# EAGLE design ApHSC (EAGLE 7.2.0)
ApHSC <https://goo.gl/t2CsID> Arduino powered Heated Seats Controller Software <https://github.com/avluis/ApHSC> | Hardware <https://github.com/avluis/ApHSC-Hardware>
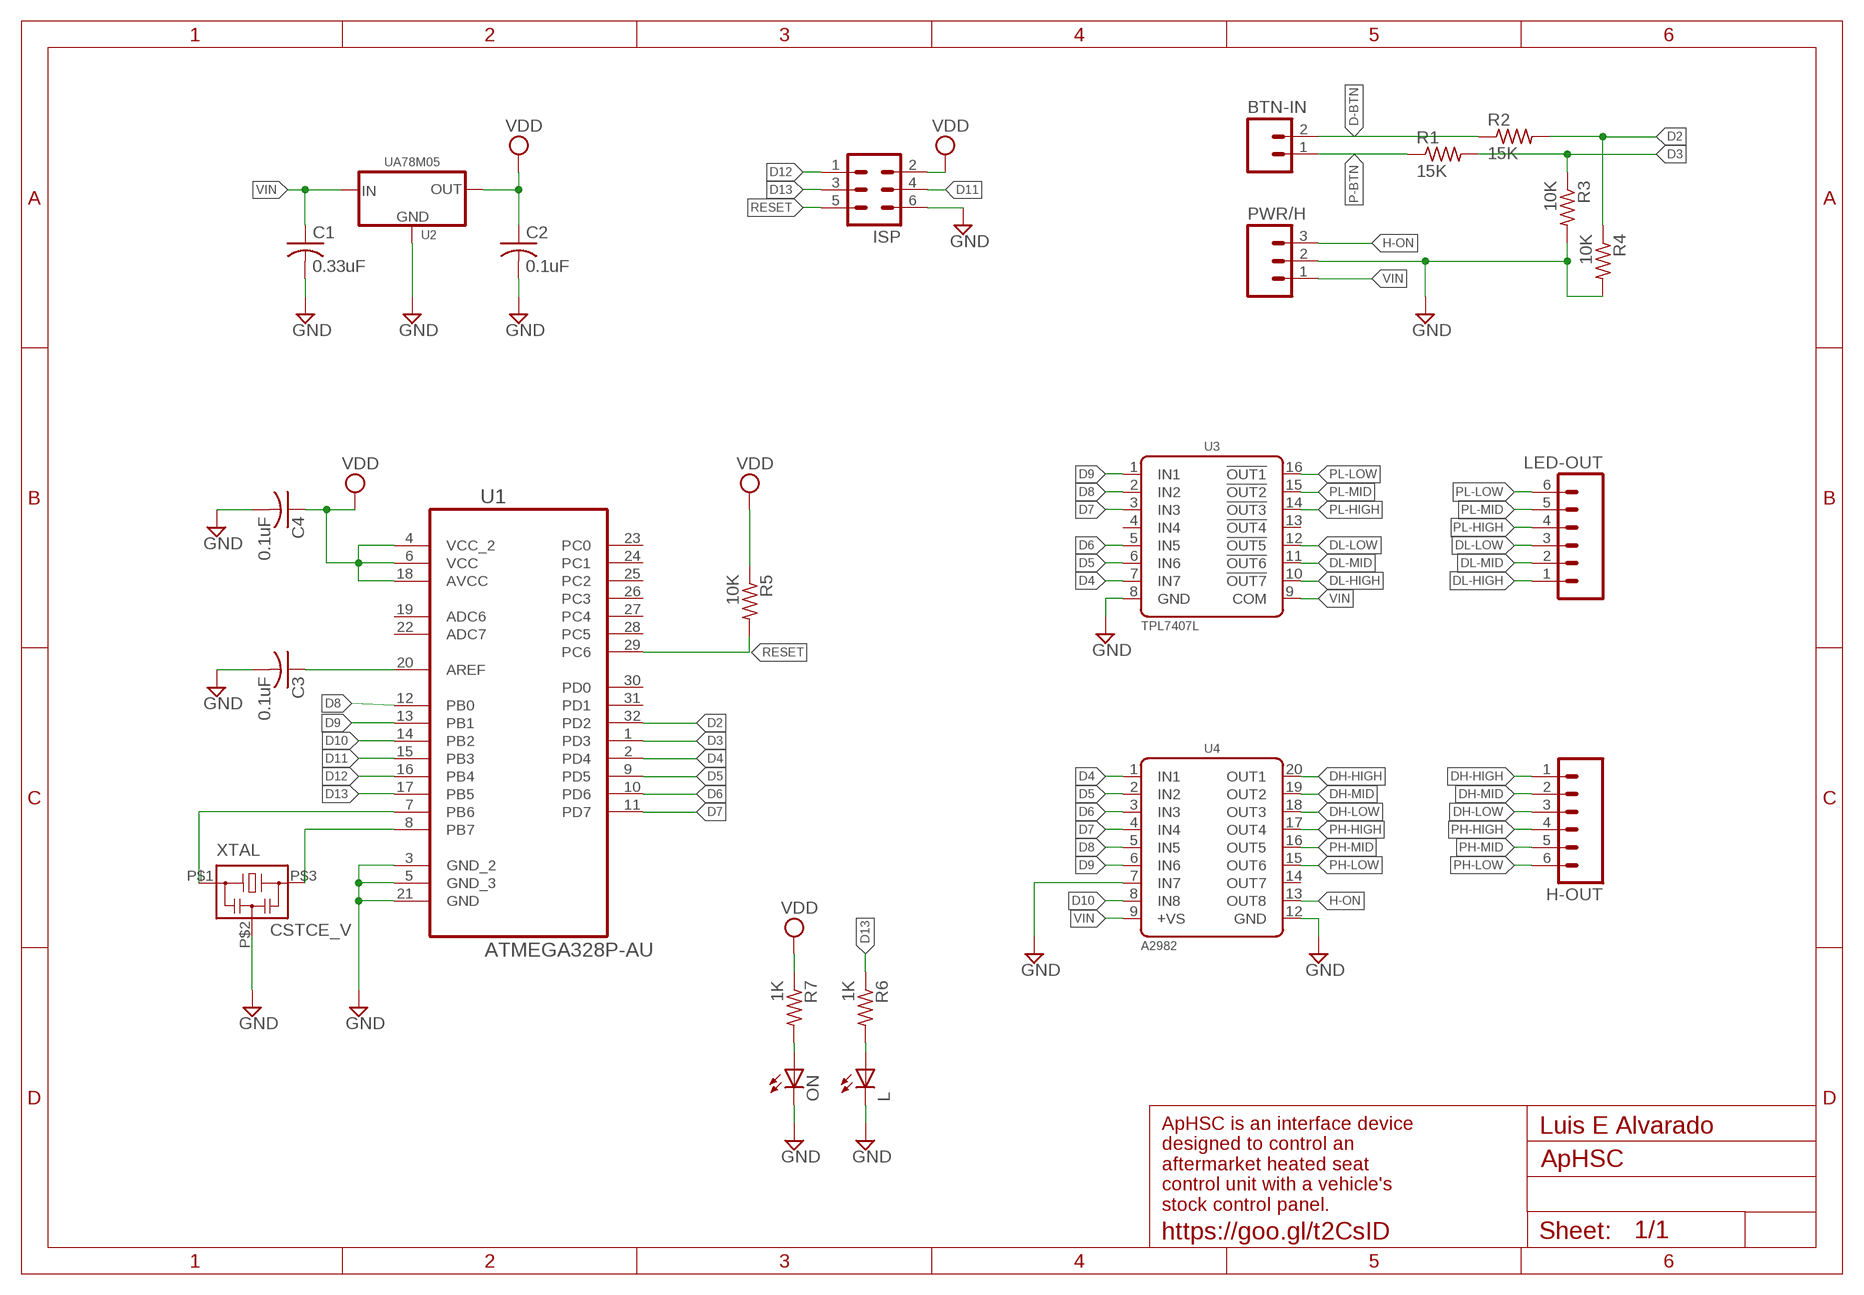
[diagram p0: schematic, sheet 1]

## Parts
BTN-IN  M02PTH  [1X02]
C1  0.33uF  C-USC0603  [C0603]
C2  0.1uF  C-USC0603  [C0603]
C3  0.1uF  C-USC0603  [C0603]
C4  0.1uF  C-USC0603  [C0603]
H-OUT  M06SIP  [1X06]
ISP  MA03-2  [MA03-2]
L  LEDCHIP-LED0603  [CHIP-LED0603]
LED-OUT  M06SIP  [1X06]
ON  LEDCHIP-LED0603  [CHIP-LED0603]
PWR/H  M03PTH  [1X03]
R1  15K  R-US_R0603  [R0603]
R2  15K  R-US_R0603  [R0603]
R3  10K  R-US_R0603  [R0603]
R4  10K  R-US_R0603  [R0603]
R5  10K  R-US_R0603  [R0603]
R6  1K  R-US_R0603  [R0603]
R7  1K  R-US_R0603  [R0603]
U1  ATMEGA328P-AU  [QFP80P900X900X120-32N]
U2  UA78M05  [SOT223]
U3  TPL7407L  [SOIC16N]
U4  A2982  [SOIC20W]
XTAL  CSTCE_V  [CSTCE_V]

## Nets
AREF: C3.1 U1.20(AREF)
D2: R2.2 R4.1 U1.32(PD2)
D3: R1.2 R3.1 U1.1(PD3)
D4: U1.2(PD4) U3.7(IN7) U4.1(IN1)
D5: U1.9(PD5) U3.6(IN6) U4.2(IN2)
D6: U1.10(PD6) U3.5(IN5) U4.3(IN3)
D7: U1.11(PD7) U3.3(IN3) U4.4(IN4)
D8: U1.12(PB0) U3.2(IN2) U4.5(IN5)
D9: U1.13(PB1) U3.1(IN1) U4.6(IN6)
D10: U1.14(PB2) U4.8(IN8)
D11: ISP.4 U1.15(PB3)
D12: ISP.1 U1.16(PB4)
D13: ISP.3 R6.1 U1.17(PB5)
D-BTN: BTN-IN.2 R2.1
DH-HIGH: H-OUT.1 U4.20(OUT1)
DH-LOW: H-OUT.3 U4.18(OUT3)
DH-MID: H-OUT.2 U4.19(OUT2)
DL-HIGH: LED-OUT.1 U3.10(!OUT7)
DL-LOW: LED-OUT.3 U3.12(!OUT5)
DL-MID: LED-OUT.2 U3.11(!OUT6)
GND: C1.2 C2.2 C3.2 C4.2 ISP.6 L.C ON.C PWR/H.2 R3.2 R4.2 U1.3(GND_2) U1.5(GND_3) U1.21(GND) U2.2(GND) U3.8(GND) U4.7(IN7) U4.12(GND) XTAL.P$2
H-ON: PWR/H.3 U4.13(OUT8)
N$1: L.A R6.2
N$3: ON.A R7.2
P-BTN: BTN-IN.1 R1.1
PB6: U1.7(PB6) XTAL.P$1
PB7: U1.8(PB7) XTAL.P$3
PH-HIGH: H-OUT.4 U4.17(OUT4)
PH-LOW: H-OUT.6 U4.15(OUT6)
PH-MID: H-OUT.5 U4.16(OUT5)
PL-HIGH: LED-OUT.4 U3.14(!OUT3)
PL-LOW: LED-OUT.6 U3.16(!OUT1)
PL-MID: LED-OUT.5 U3.15(!OUT2)
RESET: ISP.5 R5.2 U1.29(PC6)
VDD: C2.1 C4.1 ISP.2 R5.1 R7.1 U1.4(VCC_2) U1.6(VCC) U1.18(AVCC) U2.3(OUT)
VIN: C1.1 PWR/H.1 U2.1(IN) U3.9(COM) U4.9(+VS)
Unconnected: U1.19(ADC6) U1.22(ADC7) U1.23(PC0) U1.24(PC1) U1.25(PC2) U1.26(PC3) U1.27(PC4) U1.28(PC5) U1.30(PD0) U1.31(PD1) U3.4(IN4) U3.13(!OUT4) U4.14(OUT7)

## Notes on the sheet
- Luis E Alvarado
- ApHSC is an interface device
  designed to control an
  aftermarket heated seat
  control unit with a vehicle's
  stock control panel.
- https://goo.gl/t2CsID

## Library data of the parts
BTN-IN = SparkFun-Connectors:M02: Standard 2-pin 0.1" header. Use with - straight break away headers ( PRT-00116) - right angle break away headers (PRT-00553) - swiss pins (PRT-00743) - machine pins (PRT-00117) - female headers (PRT-00115) Molex polarized connector foot print use with: PRT-08233 with associated crimp pins and housings. 2.54_SCREWTERM for use with PRT-10571. 3.5mm Screw Terminal footprints for PRT-08084 5mm Screw Terminal footprints for use with PRT-08433
C1-C4 = rcl:C-US: CAPACITOR, American symbol
H-OUT LED-OUT = SparkFun-Connectors:M06: Header 6 Standard 6-pin 0.1" header. Use with straight break away headers (SKU : PRT-00116), right angle break away headers (PRT-00553), swiss pins (PRT-00743), machine pins (PRT-00117), and female headers (PRT-00115). Molex polarized connector foot print use with SKU : PRT-08094 with associated crimp pins and housings. NOTES ON THE VARIANTS LOCK and LOCK_LONGPADS... This footprint was designed to help hold the alignment of a through-hole component (i.e. 6-pin header) while soldering it into place. You may notice that each hole has been shifted either up or down by 0.005 of an inch from it's more standard position (which is a perfectly straight line). This slight alteration caused the pins (the squares in the middle) to touch the edges of the holes. Because they are alternating, it causes a "brace" to hold the component in place. 0.005 has proven to be the perfect amount of "off-center" position when using our standard breakaway headers. Although looks a little odd when you look at the bare footprint, once you have a header in there, the alteration is very hard to notice. Also,if you push a header all the way into place, it is covered up entirely on the bottom side. This idea of altering the position of holes to aid alignment will be further integrated into the Sparkfun Library for other footprints. It can help hold any component with 3 or more connection pins.
ISP = con-lstb:MA03-2: PIN HEADER; OC_FARNELL: unknown; OC_NEWARK: unknown
L ON = led:LED: LED OSRAM: - CHIPLED LG R971, LG N971, LY N971, LG Q971, LY Q971, LO R971, LY R971 LH N974, LH R974 LS Q976, LO Q976, LY Q976 LO Q996 - Hyper CHIPLED LW Q18S LB Q993, LB Q99A, LB R99A - SideLED LS A670, LO A670, LY A670, LG A670, LP A670 LB A673, LV A673, LT A673, LW A673 LH A674 LY A675 LS A676, LA A676, LO A676, LY A676, LW A676 LS A679, LY A679, LG A679 - Hyper Micro SIDELED® LS Y876, LA Y876, LO Y876, LY Y876 LT Y87S - SmartLED LW L88C, LW L88S LB L89C, LB L89S, LG L890 LS L89K, LO L89K, LY L89K LS L896, LA L896, LO L896, LY L896 - TOPLED LS T670, LO T670, LY T670, LG T670, LP T670 LSG T670, LSP T670, LSY T670, LOP T670, LYG T670 LG T671, LOG T671, LSG T671 LB T673, LV T673, LT T673, LW T673 LH T674 LS T676, LA T676, LO T676, LY T676, LB T676, LH T676, LSB T676, LW T676 LB T67C, LV T67C, LT T67C, LS T67K, LO T67K, LY T67K, LW E67C LS E67B, LA E67B, LO E67B, LY E67B, LB E67C, LV E67C, LT E67C LW T67C LS T679, LY T679, LG T679 LS T770, LO T770, LY T770, LG T770, LP T770 LB T773, LV T773, LT T773, LW T773 LH T774 LS E675, LA E675, LY E675, LS T675 LS T776, LA T776, LO T776, LY T776, LB T776 LHGB T686 LT T68C, LB T68C - Hyper Mini TOPLED® LB M676 - Mini TOPLED Santana® LG M470 LS M47K, LO M47K, LY M47K Source: http://www.osram.convergy.de LUXEON: - LUMILED® LXK2-PW12-R00, LXK2-PW12-S00, LXK2-PW14-U00, LXK2-PW14-V00 LXK2-PM12-R00, LXK2-PM12-S00, LXK2-PM14-U00 LXK2-PE12-Q00, LXK2-PE12-R00, LXK2-PE12-S00, LXK2-PE14-T00, LXK2-PE14-U00 LXK2-PB12-K00, LXK2-PB12-L00, LXK2-PB12-M00, LXK2-PB14-N00, LXK2-PB14-P00, LXK2-PB14-Q00 LXK2-PR12-L00, LXK2-PR12-M00, LXK2-PR14-Q00, LXK2-PR14-R00 LXK2-PD12-Q00, LXK2-PD12-R00, LXK2-PD12-S00 LXK2-PH12-R00, LXK2-PH12-S00 LXK2-PL12-P00, LXK2-PL12-Q00, LXK2-PL12-R00 Source: www.luxeon.com KINGBRIGHT: KA-3528ASYC Source: www.kingbright.com
PWR/H = SparkFun-Connectors:M03: Header 3 Standard 3-pin 0.1" header. Use with straight break away headers (SKU : PRT-00116), right angle break away headers (PRT-00553), swiss pins (PRT-00743), machine pins (PRT-00117), and female headers (PRT-00115). Molex polarized connector foot print use with SKU : PRT-08232 with associated crimp pins and housings.
R1-R7 = resistor:R-US_: RESISTOR, American symbol
U1 = Atmel_By_element14_Batch_1-00:ATMEGA328P-AU: 8-bit Microcontroller with In-System Programmable Flash; MPN: ATMEGA328P-AU; OC_FARNELL: 1715486; OC_NEWARK: 14R4631; PACKAGE: TQFP-32; SUPPLIER: Atmel
U2 = Roylib Regulator:UA78M05: μA78Mxx Positive-Voltage Regulators
U3 = Roylib Drivers:TPL7407L: 40V 7-Channel Low Side Driver
U4 = Roylib Drivers:A2982: 8-Channel Source Driver
XTAL = murata-filter:CSTCE_V

## Board
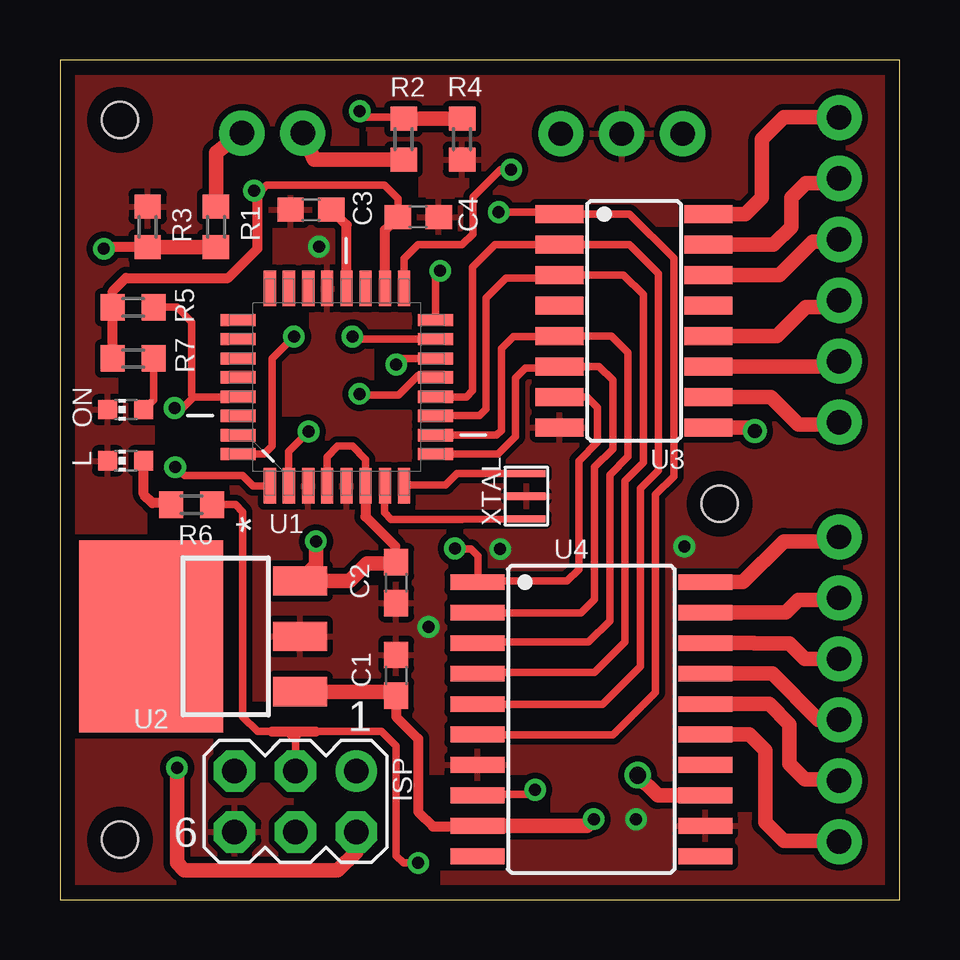
[diagram p1: board, top side]
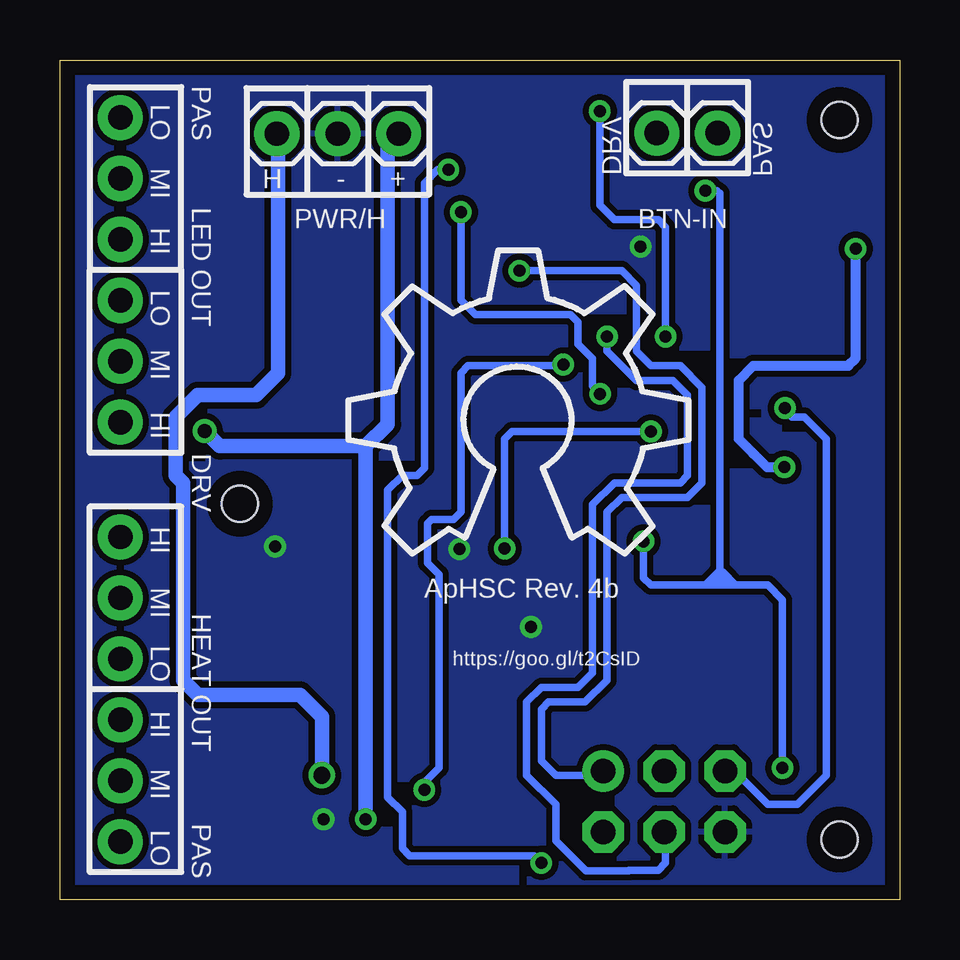
[diagram p2: board, bottom side, seen from below]

Size 35 x 35 mm. Coordinates in mm from the lower left corner, seen from the top.
Outline: 0,0 35,0 35,35 0,35 0,0
Copper layers (1*16): Top 0.035mm / dielectric 1.5mm / Bottom 0.035mm
Design rules "default *": minimum track width 10mil, minimum drill 0.5mm, track to track 10mil, track to pad 10mil, pad to pad 10mil, via to via 10mil, smd to smd 8mil, copper to edge 24mil, drill to drill 8mil, minimum pad ring 14mil, minimum via ring 8mil, stop-mask expansion 4mil, vias tented up to drill 0mil, thermal gap 10mil
Holes 1.5 mm at 2.5,2.5 2.5,32.5 27.5,16.5
tRestrict: area 9.8,18 to 12.2,18.6; area 13.1,21.3 to 13.4,23.2; area 12.8,20.4 to 14.9,20.7; area 12.5,13.1 to 13.7,13.4; area 15.5,1.2 to 16.5,1.5; area 15.5,0.3 to 15.8,1.5; area 6.4,5.8 to 6.7,7; area 8.2,4.9 to 8.8,5.2; area 24.7,27.4 to 26.2,28; area 28.7,19.5 to 29,20.7; area 7.9,7.9 to 8.8,8.2; area 3.7,14.9 to 4.3,16.2; 15 more areas
bRestrict: area 11,21.3 to 12.2,21.6; area 10.1,23.8 to 13.4,24.4; area 7.9,22.3 to 9.4,22.9; area 5.8,20.1 to 6.4,20.4; area 5.5,18 to 7.3,18.3; area 4,19.5 to 4.9,19.8; area 7.6,16.5 to 8.8,16.8; area 13.1,3 to 14.3,3.4; area 13.1,4.6 to 14.6,4.9; area 11.9,3.7 to 12.5,4.6; area 20.4,4.3 to 21,4.9; area 21,3 to 21.6,3.7; 6 more areas

### Footprints (pad centres in the part's own frame; a part is rotated, then mirrored left to right if it is on the bottom)
1X02 = drill 1.016 pad 1.88: 1 0,0; 2 2.54,0
C0603 = smd 1.1 x 1: 1 -0.85,0; 2 0.85,0
1X06 = drill 1.016 pad 1.88: 1 0,0; 2 2.54,0; 3 5.08,0; 4 7.62,0; 5 10.16,0; 6 12.7,0
MA03-2 = drill 1.016: 1 -2.54,-1.27 | drill 1.016 octagon: 2 -2.54,1.27; 3 0,-1.27; 4 0,1.27; 5 2.54,-1.27; 6 2.54,1.27
CHIP-LED0603 = smd 0.8 x 0.8: A 0,-0.75; C 0,0.75
1X03 = drill 1.016 pad 1.88: 1 0,0; 2 2.54,0; 3 5.08,0
R0603 = smd 1 x 1.1: 1 -0.85,0; 2 0.85,0
QFP80P900X900X120-32N = smd 1.473 x 0.508: 1 -4.115,2.794; 2 -4.115,2.007; 3 -4.115,1.194; 4 -4.115,0.406; 5 -4.115,-0.406; 6 -4.115,-1.194; 7 -4.115,-2.007; 8 -4.115,-2.794; 17 4.115,-2.794; 18 4.115,-2.007; 19 4.115,-1.194; 20 4.115,-0.406; 21 4.115,0.406; 22 4.115,1.194; 23 4.115,2.007; 24 4.115,2.794 | smd 0.508 x 1.473: 9 -2.794,-4.115; 10 -2.007,-4.115; 11 -1.194,-4.115; 12 -0.406,-4.115; 13 0.406,-4.115; 14 1.194,-4.115; 15 2.007,-4.115; 16 2.794,-4.115; 25 2.794,4.115; 26 2.007,4.115; 27 1.194,4.115; 28 0.406,4.115; 29 -0.406,4.115; 30 -1.194,4.115; 31 -2.007,4.115; 32 -2.794,4.115
SOT223 = smd 1.219 x 2.235: 1 -2.311,-3.099; 2 0,-3.099; 3 2.311,-3.099 | smd 8 x 6: 4 0,3.099
SOIC16N = smd 2 x 0.75: 1 -3.1,4.445; 2 -3.1,3.175; 3 -3.1,1.905; 4 -3.1,0.635; 5 -3.1,-0.635; 6 -3.1,-1.905; 7 -3.1,-3.175; 8 -3.1,-4.445; 9 3.1,-4.445; 10 3.1,-3.175; 11 3.1,-1.905; 12 3.1,-0.635; 13 3.1,0.635; 14 3.1,1.905; 15 3.1,3.175; 16 3.1,4.445
SOIC20W = smd 2.25 x 0.65: 1 -4.75,5.715; 2 -4.75,4.445; 3 -4.75,3.175; 4 -4.75,1.905; 5 -4.75,0.635; 6 -4.75,-0.635; 7 -4.75,-1.905; 8 -4.75,-3.175; 9 -4.75,-4.445; 10 -4.75,-5.715; 11 4.75,-5.715; 12 4.75,-4.445; 13 4.75,-3.175; 14 4.75,-1.905; 15 4.75,-0.635; 16 4.75,0.635; 17 4.75,1.905; 18 4.75,3.175; 19 4.75,4.445; 20 4.75,5.715
CSTCE_V = smd 0.3 x 1.6: P$1 -0.95,0; P$2 0,0; P$3 0.95,0

### Placement (x,y rotation side)
BTN-IN  7.58,31.95 180 bottom
C1  14.02,9.35 90 top
C2  14.02,13.21 270 top
C3  10.46,28.75 180 top
C4  14.94,28.45 0 top
H-OUT  32.49,15.11 270 bottom
ISP  9.82,4.09 180 top
L  2.74,18.29 90 top
LED-OUT  32.49,19.9 90 bottom
ON  2.74,20.42 90 top
PWR/H  20.88,31.93 180 bottom
R1  6.5,28.04 270 top
R2  14.33,31.7 90 top
R3  3.66,28.04 90 top
R4  16.76,31.7 270 top
R5  3.05,24.69 0 top
R6  5.49,16.46 180 top
R7  3.05,22.56 0 top
U1  11.54,21.36 90 top
U2  6.91,10.97 90 top
U3  23.93,24.13 0 top
U4  22.15,7.52 0 top
U$1  [OSHW_10X500_NOTEXT]  22.97,14.39 0 bottom
XTAL  19.44,16.81 90 top

### Tracks (layer width: path | path; a pad name or v marks a point on that pad's centre or on a via)
AREF
  Top 0.406: U1.20 11.95,28.12 C3.1
D2  (via drill 0.5)
  Top 0.305: U1.32 8.51,18.57 8.84,18.9 8.84,22.55 v9.75,23.47 | R2.2 14.26,32.61 12.75,32.61 v12.5,32.87
  Top 0.61: R2.2 R4.1
  Bottom 0.305: v9.75,23.47 9.75,28.04 10.06,28.35 11.89,28.35 12.5,28.96 v12.5,32.87
D3  (via drill 0.5)
  Top 0.305: U1.1 8.05,17.25 7.62,17.68 5.49,17.68 5.21,17.68 v4.8,18.02
  Top 0.406: R3.1 1.89,27.19 v1.83,27.13
  Top 0.61: R3.1 R1.2
  Bottom 0.406: v1.83,27.13 1.83,22.55 2.13,22.25 6.1,22.25 6.71,21.64 6.71,19.2 6.1,18.59 5.52,18.02 v4.8,18.02
D4  (via drill 0.5)
  Top 0.305: 17.44,13.27 21.14,13.27 21.64,13.77 21.64,18.29 22.42,19.06 22.42,20.51 21.97,20.95 U3.7 | 17.44,13.27 U4.1 | U1.2 9.54,18.68 v10.36,19.51 | 17.44,13.27 17.44,14.31 17.14,14.61 16.48,14.61 v16.46,14.63
  Bottom 0.305: v16.46,14.63 16.46,19.2 16.15,19.51 v10.36,19.51
D5
  Top 0.305: U1.9 18.26,18.57 19,19.3 19,21.74 19.41,22.15 19.94,22.15 | U4.2 17.42,11.94 21.72,11.94 22.29,12.51 22.29,18.02 23.05,18.78 23.05,21.65 22.48,22.23 U3.6
  Top 0.406: 19.94,22.15 U3.6
D6
  Top 0.305: U1.10 18.2,19.36 18.4,19.56 18.4,22.97 18.9,23.47 20.8,23.47 U3.5 22.99,23.5 23.69,22.8 23.69,18.47 22.92,17.7 22.92,11.62 22.04,10.73 17.44,10.73 U4.3
D7
  Top 0.305: U1.11 17.49,20.17 17.77,20.45 17.77,25.08 18.59,25.91 20.7,25.91 U3.3 23.5,26.04 24.32,25.21 24.32,18.21 23.56,17.45 23.56,10.73 22.29,9.46 17.44,9.46 U4.4
D8
  Top 0.305: U1.12 16.94,20.95 17.2,21.21 17.2,26.36 18.14,27.3 U3.2 23.75,27.3 24.96,26.1 24.96,17.89 24.19,17.13 24.19,9.72 22.61,8.13 17.42,8.13 U4.5
D9  (via drill 0.5)
  Top 0.305: U4.6 17.42,6.86 23.05,6.86 24.83,8.64 24.83,16.88 25.59,17.64 25.59,26.73 23.75,28.57 U3.1 20.75,28.65 v18.29,28.65 | v12.48,21.08 12.54,21.03 14.11,21.03 14.92,21.84 15.58,21.84 U1.13
  Bottom 0.305: v18.29,28.65 18.29,24.99 17.68,24.38 13.72,24.38 13.41,24.08 13.41,23.16 12.8,22.55 12.8,21.4 v12.48,21.08
D10  (via drill 0.5)
  Top 0.305: v19.81,4.57 19.62,4.38 17.44,4.38 U4.8 | U1.14 14.28,22.55 v14.02,22.3
  Bottom 0.305: v19.81,4.57 19.81,4.88 19.2,5.49 19.2,13.55 19.68,14.03 19.68,15.67 19.51,15.85 18.59,15.85 18.29,16.15 18.29,21.95 17.98,22.25 14.07,22.25 v14.02,22.3
D11  (via drill 0.5)
  Top 0.305: U1.15 12.29,23.37 v12.19,23.47
  Bottom 0.305: v12.19,23.47 12.19,22.86 10.97,21.64 9.45,21.64 8.84,21.03 8.84,17.68 9.14,17.37 11.89,17.37 12.8,16.46 12.8,9.45 13.41,8.84 14.94,8.84 15.54,8.23 15.54,5.18 14.33,3.96 14.33,2.45 13.08,1.21 11.29,1.21 11.28,1.22 10.06,1.22 9.75,1.52 9.75,2.76 ISP.4
D12  (via drill 0.5)
  Top 0.305: U1.16 15.66,26.02 v15.85,26.21
  Bottom 0.305: v15.85,26.21 11.58,26.21 10.97,25.6 10.97,22.86 10.36,22.25 9.14,22.25 8.23,21.34 8.23,17.37 8.84,16.76 11.58,16.76 12.19,16.15 12.19,9.14 13.11,8.23 14.63,8.23 14.94,7.92 14.94,5.79 14.33,5.18 12.54,5.18 ISP.1
D13  (via drill 0.5)
  Top 0.305: R6.1 7.32,16.46 7.62,16.15 7.62,7.62 8.23,7.01 8.84,7.01 9.45,7.01 9.75,6.71 | U1.17 14.34,26.72 14.92,27.3 16.76,27.3 17.21,27.75 17.21,29.27 17.72,29.78 18.36,30.43 v18.81,30.43 18.8,30.42 | 9.75,6.71 10.06,7.01 10.67,7.01 13.41,7.01 14.02,6.4 14.02,1.83 14.33,1.52 v14.94,1.52 | ISP.3 9.82,6.64 9.75,6.71
  Top 0.406: 8.84,7.01 10.67,7.01
  Bottom 0.305: v14.94,1.52 15.24,1.83 15.54,1.83 20.42,1.83 20.73,2.13 20.73,3.66 21.34,4.27 21.34,17.07 20.73,17.68 20.12,17.68 19.81,17.98 19.81,29.87 19.25,30.43 v18.81,30.43
D-BTN
  Top 0.61: R2.1 10.6,30.85 BTN-IN.2
DH-HIGH
  Top 0.61: U4.20 28.47,13.23 30.18,14.94 32.31,14.94 H-OUT.1
DH-LOW
  Top 0.61: U4.18 28.93,10.69 28.96,10.67 30.42,10.67 31.05,10.03 H-OUT.3
DH-MID
  Top 0.61: U4.19 30.25,11.96 30.79,12.5 32.41,12.5 H-OUT.2
DL-HIGH
  Top 0.61: U3.10 29.64,20.95 30.79,19.81 32.4,19.81 LED-OUT.1
DL-LOW
  Top 0.61: U3.12 29.9,23.5 31.09,24.69 32.19,24.69 LED-OUT.3
DL-MID
  Top 0.61: U3.11 32.27,22.23 LED-OUT.2
GND  (via drill 0.5)
  other vias: 18.35,14.61 10.79,27.22 15.37,11.37 26.04,14.72 24.02,3.34
  pour Top: 0,35 35,35 35,0 0,0
  pour Bottom: 0,35 35,35 35,0 0,0
H-ON  (via drill 0.7)
  Top 0.61: U4.13 24.92,4.34 v24.08,5.18
  Bottom 0.61: v24.08,5.18 24.08,7.62 24.99,8.53 29.26,8.53 29.87,9.14 29.87,17.37 30.18,17.68 30.18,20.12 29.26,21.03 26.82,21.03 25.91,21.95 25.91,31.88 PWR/H.3
N$1
  Top 0.406: R6.2 4.57,16.52 3.86,16.52 3.49,16.89 L.A
N$3
  Top 0.305: R7.2 3.9,20.83 ON.A
P-BTN
  Top 0.61: R1.1 6.5,31.13 BTN-IN.1
PB6
  Top 0.305: U1.7 13.53,17.22 13.53,16.13 13.8,15.85 16.76,15.85 XTAL.P$1
PB7
  Top 0.305: U1.8 14.36,17.27 16.07,17.27 16.56,17.77 XTAL.P$3
PH-HIGH
  Top 0.61: U4.17 29.69,9.42 31.62,7.49 H-OUT.4
PH-LOW
  Top 0.61: U4.15 28.74,6.88 29.4,6.22 29.4,3.21 30.18,2.44 32.46,2.44 H-OUT.6
PH-MID
  Top 0.61: U4.16 29.57,8.15 30.42,7.3 30.42,5.65 31.05,5.02 32.42,5.02 H-OUT.5
PL-HIGH
  Top 0.61: U3.14 30,26.04 31.39,27.43 32.4,27.43 LED-OUT.4
PL-LOW
  Top 0.61: U3.16 28.57,28.57 29.26,29.26 29.26,31.7 30.18,32.61 32.47,32.61 LED-OUT.6
PL-MID
  Top 0.61: U3.15 29.74,27.3 30.48,28.04 30.48,29.26 31.09,29.87 32.3,29.87 LED-OUT.5
RESET  (via drill 0.5)
  Top 0.305: R5.2 4.88,24.69 5.49,24.08 5.49,21.03 5.56,20.95 | U1.29 5.56,20.95 | v4.78,20.48 5.11,20.5 5.56,20.95
  Bottom 0.305: ISP.5 6.88,5.36 5.49,3.96 4.27,3.96 3.05,5.18 3.05,19.2 3.96,20.12 4.48,20.12 v4.78,20.48
VDD  (via drill 0.5)
  Top 0.305: 13.97,14.11 C2.1 | U1.4 11.14,18.45 11.58,18.9 12.19,18.9 12.74,18.35 U1.6 | C4.1 14.09,29.22 13.53,29.78 8.62,29.78 8.39,29.55 v8.09,29.55
  Top 0.406: U1.6 12.74,15.96 13.97,14.73 13.97,14.11 | R7.1 R5.1 2.2,25.36 2.74,25.91 7.01,25.91 8.23,27.13 8.23,29.41 v8.09,29.55 | U1.18 13.55,27.91 C4.1
  Top 0.61: C2.1 13.98,14.02 12.8,14.02 12.06,13.28 U2.3 10.67,13.94 v10.67,14.94 | ISP.2 12.36,1.99 11.58,1.22 5.18,1.22 4.88,1.52 v4.88,5.49
  Bottom 0.305: v10.67,14.94 10.67,13.41 10.36,13.11 7.62,13.11 | v4.88,5.49 4.88,12.5 5.49,13.11 6.71,13.11 7.32,13.11 | 7.62,13.11 7.32,13.11 | 7.49,13.72 7.49,13.96 7.49,28.89 7.49,29.44 7.61,29.55 v8.09,29.55 | 7.49,13.72 7.49,13.28 7.32,13.11 | 7.62,13.11 7.62,13.59 7.49,13.72 | 7.49,13.72 8.06,13.14 6.86,13.14 7.37,13.65 7.43,13.65 7.43,13.46 7.24,13.27
VIN  (via drill 0.5, 0.6)
  Top 0.406: C1.1 14.02,7.62 14.94,6.71 14.94,3.66 15.54,3.05 17.37,3.05 U4.9
  Top 0.61: U2.1 13.86,8.66 C1.1 | U4.9 21.97,3.07 v22.25,3.35 | U3.9 28.82,19.68 v28.97,19.53
  Bottom 0.61: PWR/H.1 21.34,31.47 21.34,19.81 22.25,18.9 | v22.25,3.35 22.25,18.9 | 22.25,18.9 28.33,18.9 v28.97,19.53

### Text on the board
bPlace: PAS | LO | MI | PAS | DRV | + | - | H | LED OUT | HI | LO | MI | HI | DRV | HI | ApHSC Rev. 4b | MI | HEAT OUT | LO | https://goo.gl/t2CsID | HI | MI | PAS | LO
tNames: XTAL